# EAGLE design bluz_cr2477_v1 (EAGLE 7.3.0)
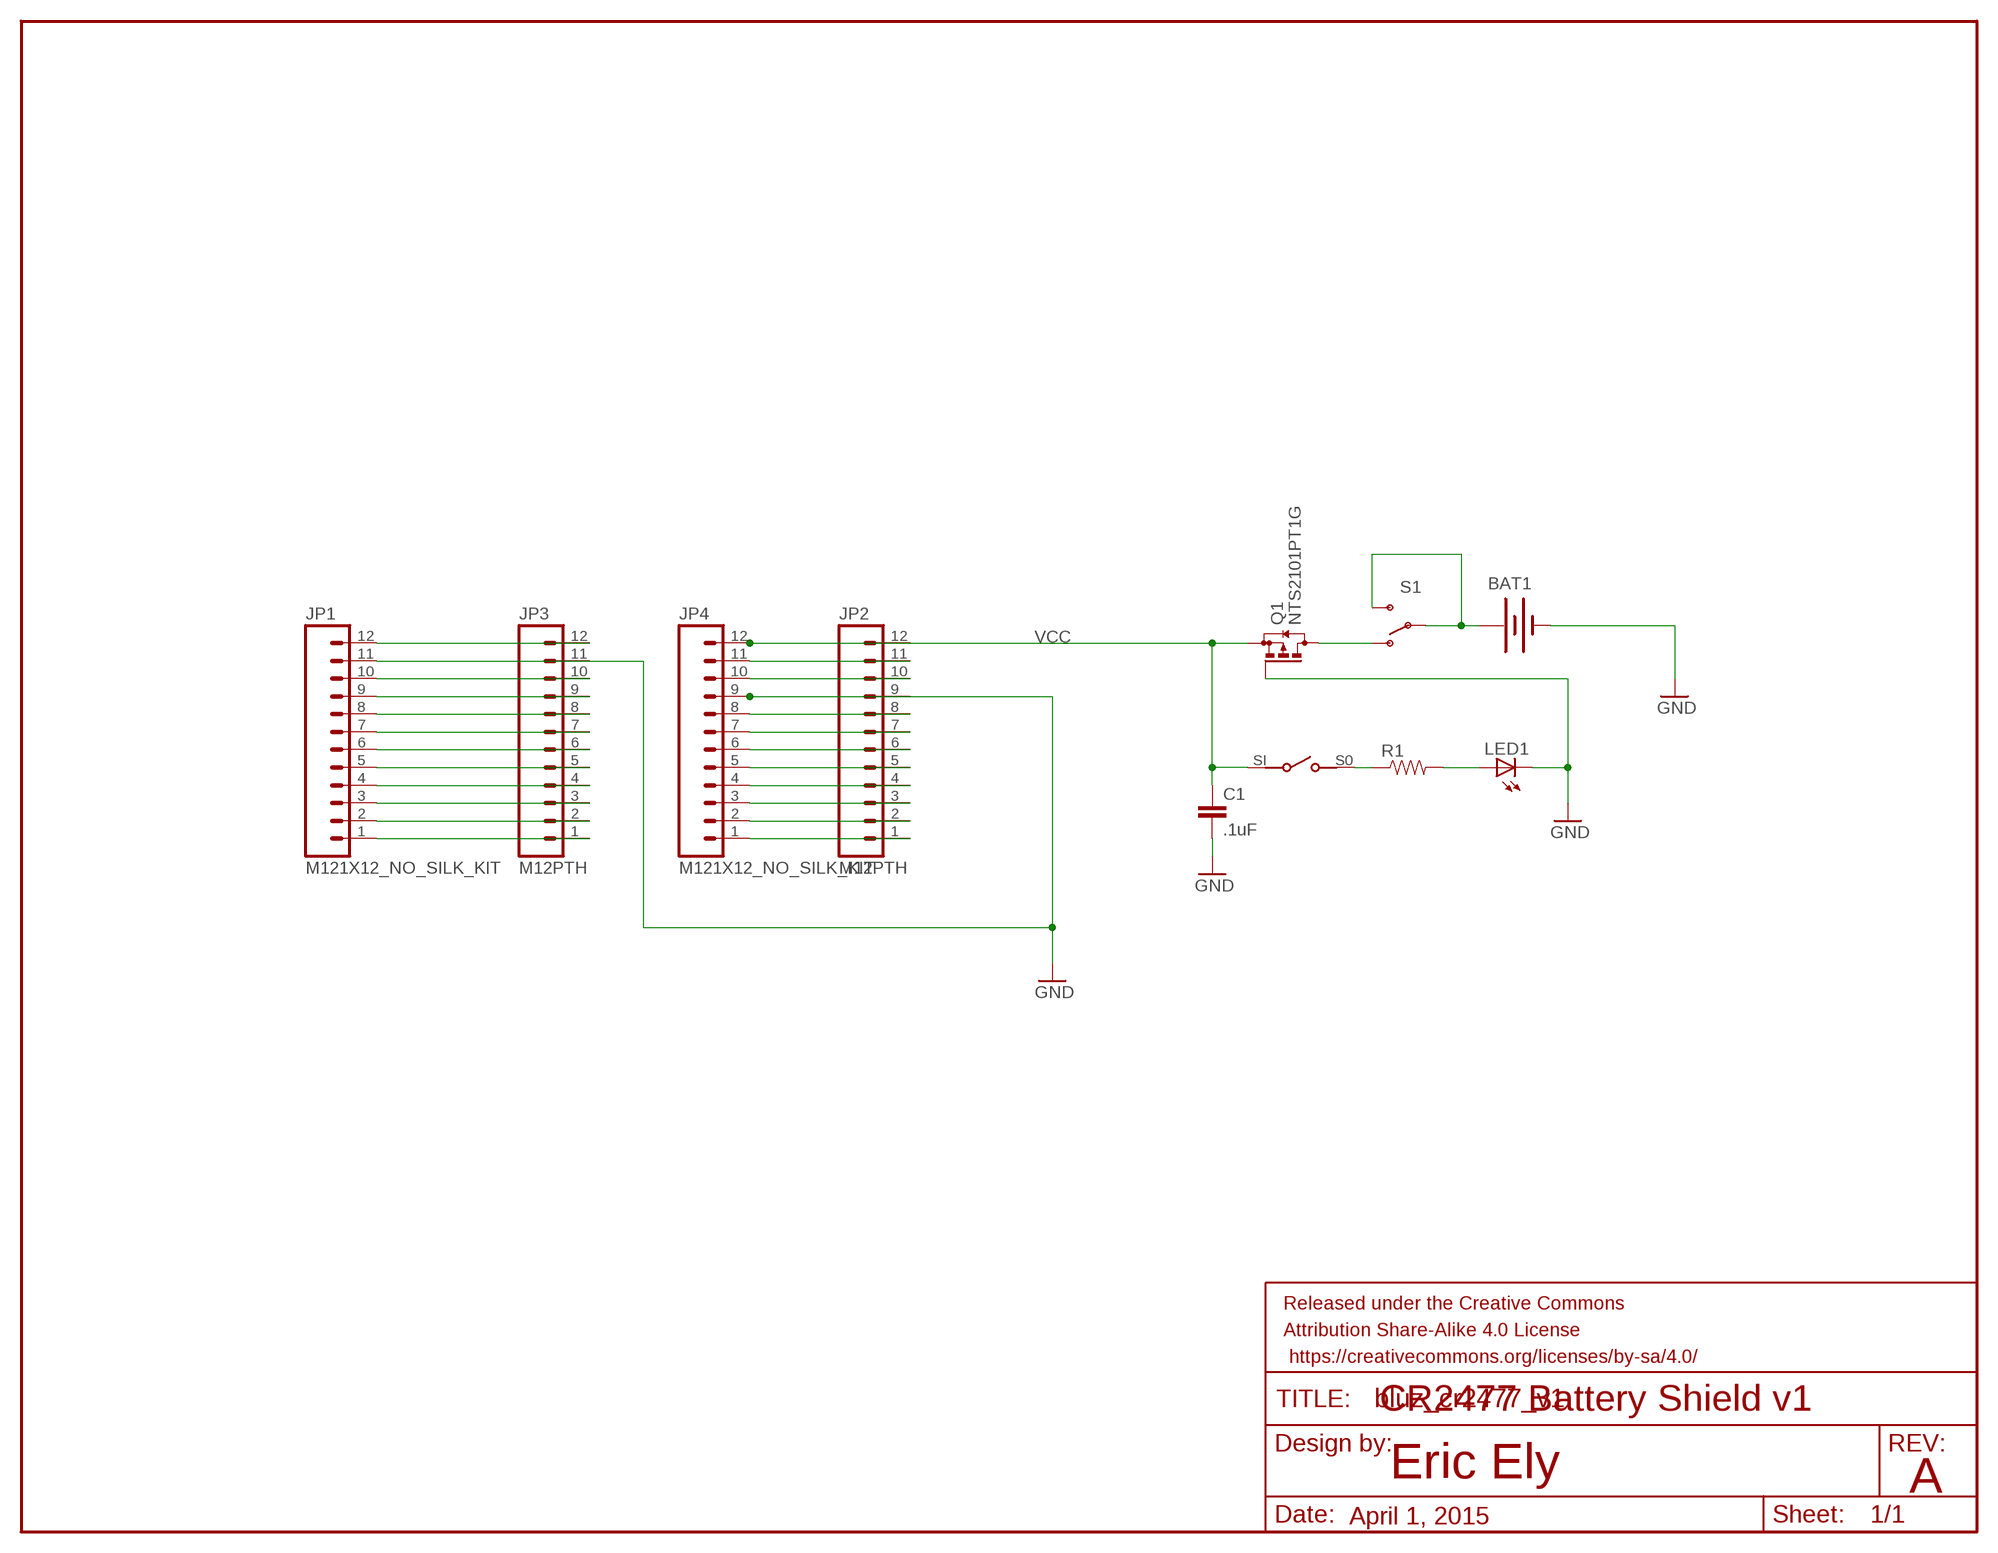
[diagram p0: schematic, sheet 1]

## Parts
BAT1  BATTERY245PTH  [BATTCON_245MM_PTH]
C1  .1uF  CAP0603-CAP  [0603-CAP]
FRAME1  FRAME-LETTER  [CREATIVE_COMMONS]
JP1  M121X12_NO_SILK_KIT  [1X12_NO_SILK_KIT]
JP2  M12PTH  [1X12]
JP3  M12PTH  [1X12]
JP4  M121X12_NO_SILK_KIT  [1X12_NO_SILK_KIT]
LED1  LEDCHIPLED_0603  [CHIPLED_0603]
Q1  NTS2101PT1G  [SOT323]
R1  RESISTOR0603-RES  [0603-RES]
S1  SWITCH-SPDTKIT  [SWITCH-SPDT_KIT]
S2  CHS-01TASMD  [CHS-01TA]

## Nets
GND: BAT1.2(-) C1.2 JP1.11 JP2.9 JP3.11 JP4.9 LED1.C Q1.1(G)
N$1: BAT1.3(+) S1.2(P) S1.3(S)
N$2: JP1.1 JP3.1
N$3: LED1.A R1.2
N$4: R1.1 S2.S0(SO)
N$5: Q1.3(D) S1.1(O)
N$6: JP1.2 JP3.2
N$7: JP1.3 JP3.3
N$8: JP1.4 JP3.4
N$9: JP1.5 JP3.5
N$10: JP1.6 JP3.6
N$11: JP1.7 JP3.7
N$12: JP1.8 JP3.8
N$13: JP1.9 JP3.9
N$14: JP1.10 JP3.10
N$16: JP1.12 JP3.12
N$17: JP2.1 JP4.1
N$18: JP2.2 JP4.2
N$19: JP2.3 JP4.3
N$20: JP2.4 JP4.4
N$21: JP2.5 JP4.5
N$22: JP2.6 JP4.6
N$23: JP2.7 JP4.7
N$24: JP2.8 JP4.8
N$25: JP2.10 JP4.10
N$26: JP2.11 JP4.11
VCC: C1.1 JP2.12 JP4.12 Q1.2(S) S2.SI(S!)

## Notes on the sheet
- CR2477 Battery Shield v1
- Eric Ely
- A
- April 1, 2015

## Library data of the parts
BAT1 = SparkFun-Electromechanical:BATTERY: Battery Holders Various common sizes : AA, AAA, 20mm coin cell and 12mm coin cell. 20MM_4LEGS, BATT-10373
C1 = SparkFun-Capacitors:CAP: Capacitor Standard 0603 ceramic capacitor, and 0.1" leaded capacitor.
FRAME1 = SparkFun-Aesthetics:FRAME-LETTER: Schematic Frame Standard 8.5x11 US Letter frame
JP1-JP4 = SparkFun-Connectors:M12: Header 12 Standard 12-pin 0.1" header. Use with straight break away headers (SKU : PRT-00116), right angle break away headers (PRT-00553), swiss pins (PRT-00743), machine pins (PRT-00117), and female headers (PRT-00115).
LED1 = led:LED: LED OSRAM: - CHIPLED LG R971, LG N971, LY N971, LG Q971, LY Q971, LO R971, LY R971 LH N974, LH R974 LS Q976, LO Q976, LY Q976 LO Q996 - Hyper CHIPLED LW Q18S LB Q993, LB Q99A, LB R99A - SideLED LS A670, LO A670, LY A670, LG A670, LP A670 LB A673, LV A673, LT A673, LW A673 LH A674 LY A675 LS A676, LA A676, LO A676, LY A676, LW A676 LS A679, LY A679, LG A679 - Hyper Micro SIDELED® LS Y876, LA Y876, LO Y876, LY Y876 LT Y87S - SmartLED LW L88C, LW L88S LB L89C, LB L89S, LG L890 LS L89K, LO L89K, LY L89K LS L896, LA L896, LO L896, LY L896 - TOPLED LS T670, LO T670, LY T670, LG T670, LP T670 LSG T670, LSP T670, LSY T670, LOP T670, LYG T670 LG T671, LOG T671, LSG T671 LB T673, LV T673, LT T673, LW T673 LH T674 LS T676, LA T676, LO T676, LY T676, LB T676, LH T676, LSB T676, LW T676 LB T67C, LV T67C, LT T67C, LS T67K, LO T67K, LY T67K, LW E67C LS E67B, LA E67B, LO E67B, LY E67B, LB E67C, LV E67C, LT E67C LW T67C LS T679, LY T679, LG T679 LS T770, LO T770, LY T770, LG T770, LP T770 LB T773, LV T773, LT T773, LW T773 LH T774 LS E675, LA E675, LY E675, LS T675 LS T776, LA T776, LO T776, LY T776, LB T776 LHGB T686 LT T68C, LB T68C - Hyper Mini TOPLED® LB M676 - Mini TOPLED Santana® LG M470 LS M47K, LO M47K, LY M47K Source: http://www.osram.convergy.de LUXEON: - LUMILED® LXK2-PW12-R00, LXK2-PW12-S00, LXK2-PW14-U00, LXK2-PW14-V00 LXK2-PM12-R00, LXK2-PM12-S00, LXK2-PM14-U00 LXK2-PE12-Q00, LXK2-PE12-R00, LXK2-PE12-S00, LXK2-PE14-T00, LXK2-PE14-U00 LXK2-PB12-K00, LXK2-PB12-L00, LXK2-PB12-M00, LXK2-PB14-N00, LXK2-PB14-P00, LXK2-PB14-Q00 LXK2-PR12-L00, LXK2-PR12-M00, LXK2-PR14-Q00, LXK2-PR14-R00 LXK2-PD12-Q00, LXK2-PD12-R00, LXK2-PD12-S00 LXK2-PH12-R00, LXK2-PH12-S00 LXK2-PL12-P00, LXK2-PL12-Q00, LXK2-PL12-R00 Source: www.luxeon.com KINGBRIGHT: KA-3528ASYC Source: www.kingbright.com
Q1 = bluze_libr:NTS2101PT1G
R1 = SparkFun-Passives:RESISTOR: Resistor Basic schematic elements and footprints for 0603, 1206, and PTH resistors.
S1 = SparkFun-Electromechanical:SWITCH-SPDT: SPDT Switch Simple slide switch, Spark Fun Electronics SKU : COM-00102 DPDT SMT slide switch, AYZ0202, SWCH-08179; PROD_ID: SWCH-08261
S2 = bluze_libr:CHS-01TA

## Board
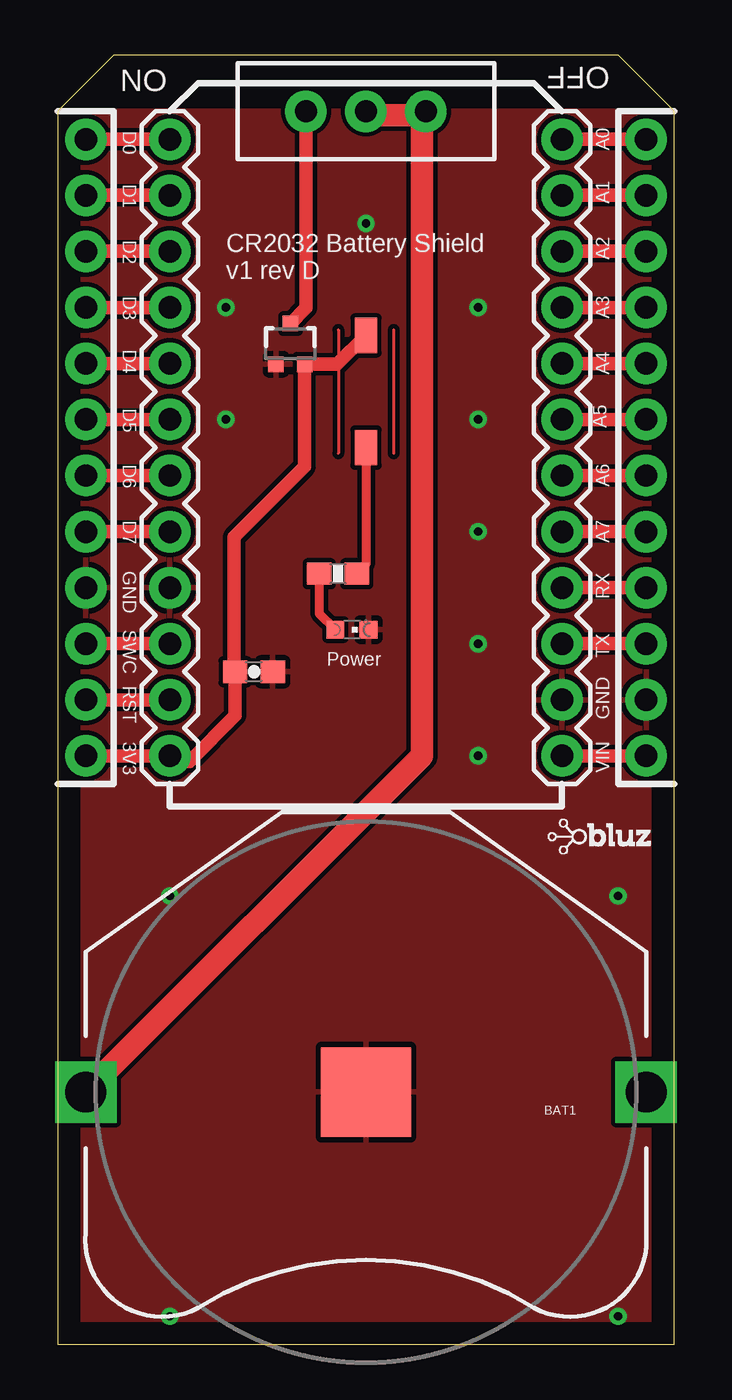
[diagram p1: board, top side]
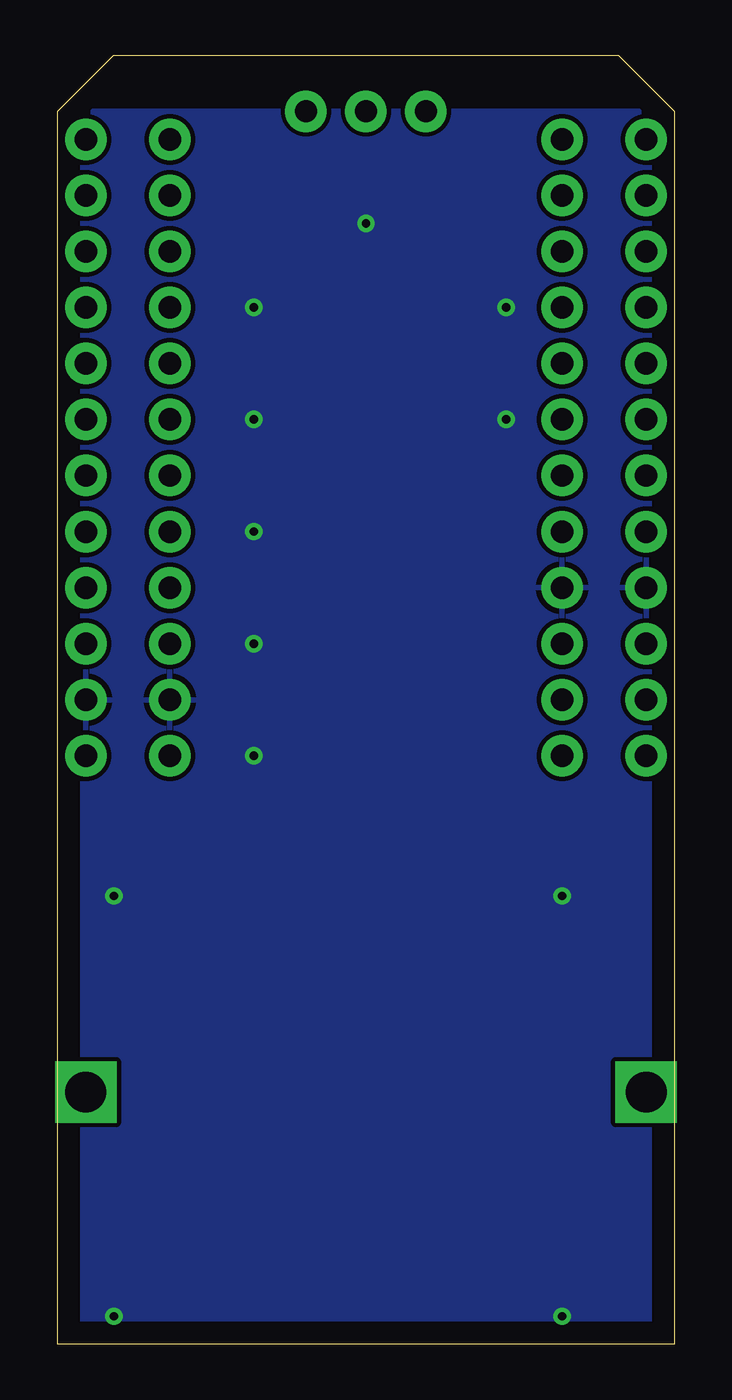
[diagram p2: board, bottom side, seen from below]

Size 27.94 x 58.42 mm. Coordinates in mm from the lower left corner, seen from the top.
Outline: 0,0 27.94,0 27.94,55.88 25.4,58.42 2.54,58.42 0,55.88 0,0
Copper layers (1*16): Top 0.035mm / dielectric 1.5mm / Bottom 0.035mm
Design rules "default *": minimum track width 10mil, minimum drill 24mil, track to track 8mil, track to pad 8mil, pad to pad 8mil, via to via 8mil, smd to smd 8mil, copper to edge 40mil, drill to drill 8mil, minimum pad ring 10mil, minimum via ring 8mil, stop-mask expansion 4mil, vias tented up to drill 22mil, thermal gap 10mil

### Footprints (pad centres in the part's own frame; a part is rotated, then mirrored left to right if it is on the bottom)
BATTCON_245MM_PTH = drill 1.854 square: 1 -12.7,0; 3 12.7,0 | smd 4.064 x 4.064: 2 0,0
0603-CAP = smd 1.1 x 1: 1 -0.85,0; 2 0.85,0
1X12_NO_SILK_KIT = drill 1.016 pad 1.88: 1 0,0; 2 2.54,0; 3 5.08,0; 4 7.62,0; 5 10.16,0; 6 12.7,0; 7 15.24,0; 8 17.78,0; 9 20.32,0; 10 22.86,0; 11 25.4,0; 12 27.94,0
1X12 = drill 1.016 pad 1.88: 1 0,0; 2 2.54,0; 3 5.08,0; 4 7.62,0; 5 10.16,0; 6 12.7,0; 7 15.24,0; 8 17.78,0; 9 20.32,0; 10 22.86,0; 11 25.4,0; 12 27.94,0
CHIPLED_0603 = smd 0.8 x 0.8: A 0,-0.75; C 0,0.75
SOT323 = smd 0.7 x 0.7: 1 -0.65,-0.925; 2 0.65,-0.925; 3 0,0.925
0603-RES = smd 1.1 x 1: 1 -0.85,0; 2 0.85,0
SWITCH-SPDT_KIT = drill 1.016 pad 1.88: 1 0,2.718; 2 0,0; 3 0,-2.718
CHS-01TA = smd 1 x 1.6: S0 0,-2.54; SI 0,2.54

### Placement (x,y rotation side)
BAT1  13.97,11.43 180 top
C1  8.89,30.48 0 top
FRAME1  21.59,-7.62 0 top  (outside the outline)
JP1  26.67,54.61 270 top
JP2  5.08,54.61 270 top
JP3  22.86,54.61 270 top
JP4  1.27,54.61 270 top
LED1  13.34,32.38 270 top
Q1  10.54,45.34 0 top
R1  12.7,34.92 180 top
S1  13.97,55.88 90 top
S2  13.97,43.18 0 top
U$1  [BLUZE_LOGO_LOW_RES]  22.23,22.23 0 top

### Tracks (layer width: path | path; a pad name or v marks a point on that pad's centre or on a via)
GND  (via drill 0.38)
  other vias: 7.62,46.99 7.62,41.91 13.97,50.8 19.05,46.99 19.05,41.91 19.05,36.83 19.05,31.75 19.05,26.67 25.4,20.32 5.08,20.32 5.08,1.27 25.4,1.27
  pour Top: 0,0 0,55.88 27.94,55.88 27.94,0
  pour Bottom: 0,0 0,55.88 27.94,55.88 27.94,0
N$1
  Top 1.016: BAT1.3 16.51,26.67 16.51,55.7 | 16.51,55.7 S1.3 | 16.51,55.7 14.15,55.7 S1.2
N$2
  Top 0.61: JP3.1 JP1.1
N$3
  Top 0.406: R1.2 11.85,33.12 LED1.A
N$4
  Top 0.406: S2.S0 13.97,35.34 R1.1
N$5
  Top 0.61: S1.1 11.25,46.98 Q1.3
N$6
  Top 0.61: JP3.2 JP1.2
N$7
  Top 0.61: JP3.3 JP1.3
N$8
  Top 0.61: JP3.4 JP1.4
N$9
  Top 0.61: JP3.5 JP1.5
N$10
  Top 0.61: JP3.6 JP1.6
N$11
  Top 0.61: JP3.7 JP1.7
N$12
  Top 0.61: JP3.8 JP1.8
N$13
  Top 0.61: JP3.9 JP1.9
N$14
  Top 0.61: JP3.10 JP1.10
N$16
  Top 0.61: JP3.12 JP1.12
N$17
  Top 0.61: JP4.1 JP2.1
N$18
  Top 0.61: JP4.2 JP2.2
N$19
  Top 0.61: JP4.3 JP2.3
N$20
  Top 0.61: JP4.4 JP2.4
N$21
  Top 0.61: JP4.5 JP2.5
N$22
  Top 0.61: JP4.6 JP2.6
N$23
  Top 0.61: JP4.7 JP2.7
N$24
  Top 0.61: JP4.8 JP2.8
N$25
  Top 0.61: JP4.10 JP2.10
N$26
  Top 0.61: JP4.11 JP2.11
VCC
  Top 0.61: JP4.12 JP2.12 5.33,26.42 5.97,26.42 8.04,28.49 C1.1 8,30.52 8,36.58 11.19,39.77 Q1.2 12.66,44.41 S2.SI

### Text on the board
tPlace: ON | OFF | CR2032 Battery Shield / v1 rev D
tNames: D0 | A0 | D1 | A1 | D2 | A2 | D3 | A3 | D4 | A4 | D5 | A5 | D6 | A6 | D7 | A7 | GND | RX | SWC | Power | TX | RST | GND | 3V3 | VIN